# EAGLE schematic Lamp Logic Board_40 BRAIN (EAGLE 9.5.1)

## Sheet 1 of 4
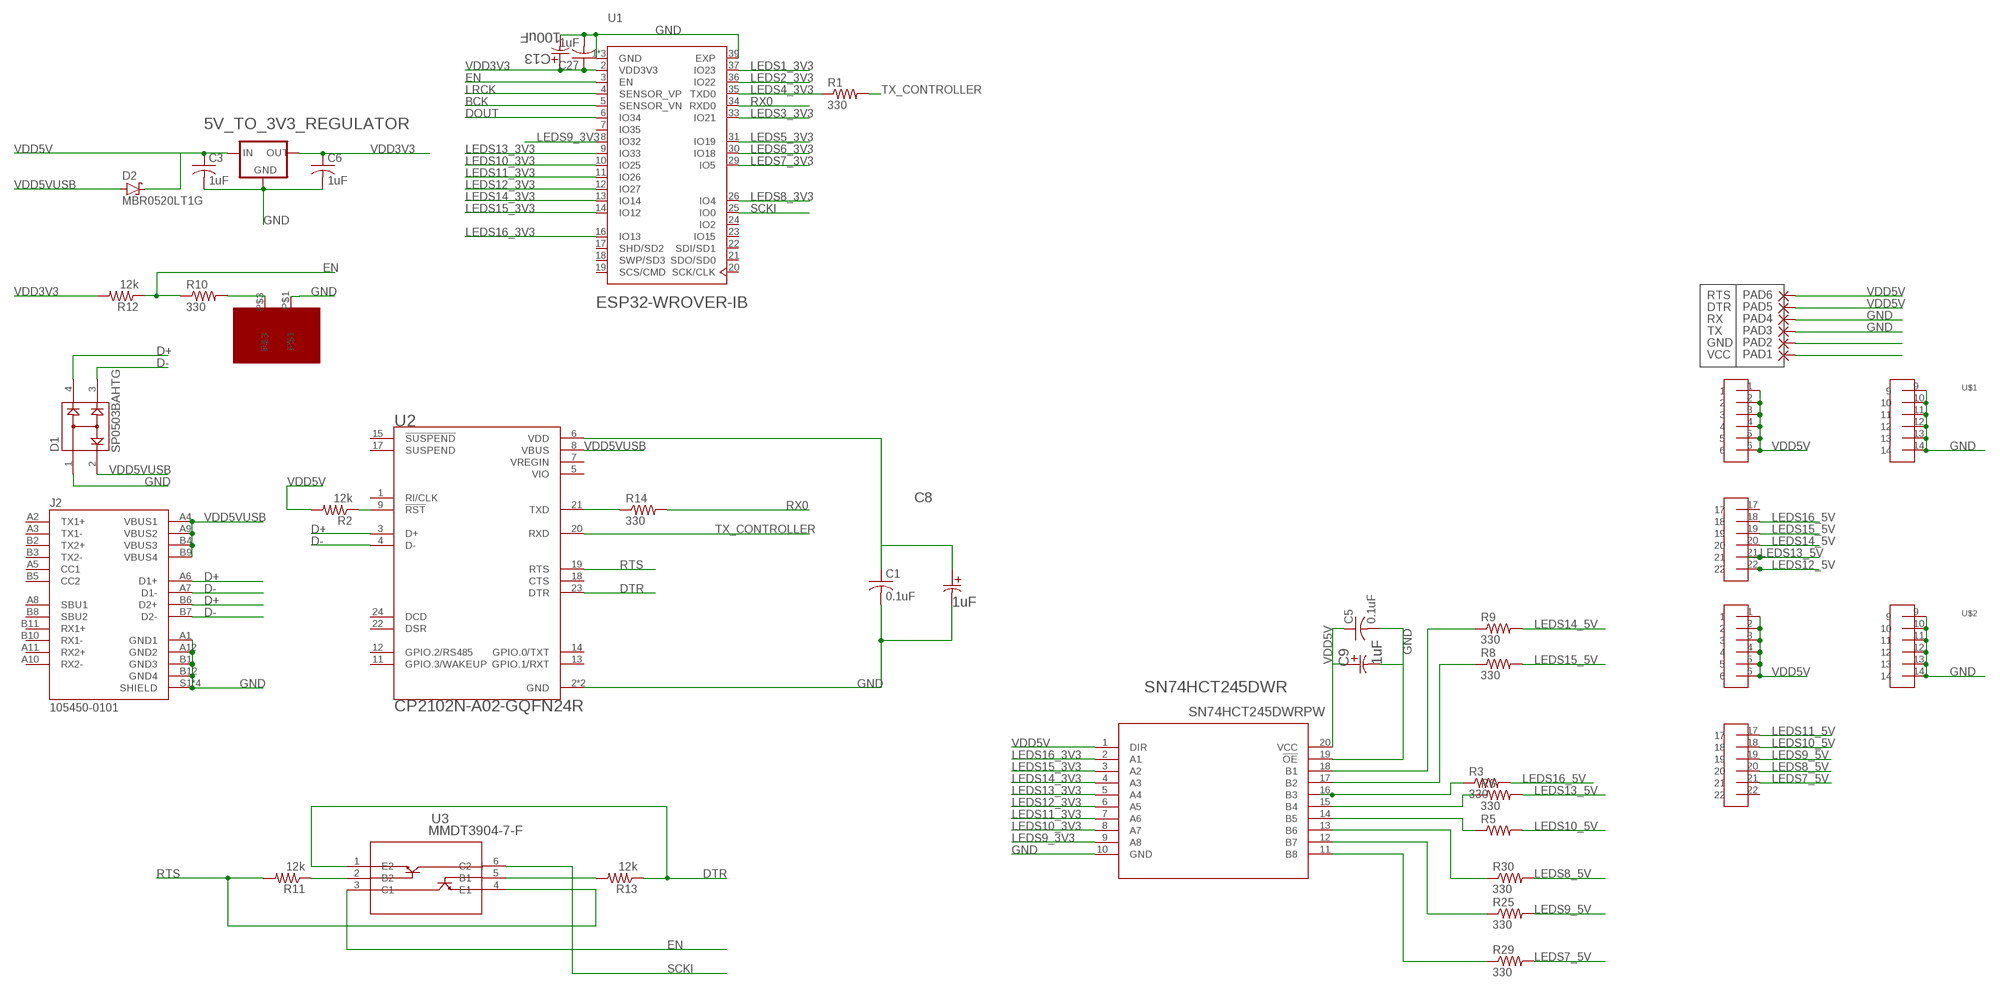
[diagram p0: schematic, sheet 1]

### Parts
5V_TO_3V3_REGULATOR  LM1117MP-1.8  [SOT223]
C1  0.1uF  C-USC0402  [C0402]
C3  1uF  C-USC0402  [C0402]
C5  0.1uF  C-USC0805  [C0805]
C6  1uF  C-USC0402  [C0402]
C8  1uF  EEEFC1V1R0R  [CAP_EEFC_B]
C9  1uF  EEEFC1V1R0R  [CAP_EEFC_B]
C13  100uF  EEEFC1V1R0R  [CAP_EEFC_B]
C27  1uF  C-USC0402  [C0402]
D1  SP0503BAHTG  [SOT143]
D2  MBR0520LT1G  [SOD-123]
J2  105450-0101  [MOLEX_105450-0101]
PAD1  VCC  WIREPADSMD1,27-254  [SMD1,27-2,54]
PAD2  GND  WIREPADSMD1,27-254  [SMD1,27-2,54]
PAD3  TX  WIREPADSMD1,27-254  [SMD1,27-2,54]
PAD4  RX  WIREPADSMD1,27-254  [SMD1,27-2,54]
PAD5  DTR  WIREPADSMD1,27-254  [SMD1,27-2,54]
PAD6  RTS  WIREPADSMD1,27-254  [SMD1,27-2,54]
R1  330  RC0603JR-070RL  [RES_0603]
R2  12k  RC0603JR-070RL  [RES_0603]
R3  330  RC0603JR-070RL  [RES_0603]
R5  330  RC0603JR-070RL  [RES_0603]
R6  330  RC0603JR-070RL  [RES_0603]
R8  330  RC0603JR-070RL  [RES_0603]
R9  330  RC0603JR-070RL  [RES_0603]
R10  330  RC0603JR-070RL  [RES_0603]
R11  12k  RC0603JR-070RL  [RES_0603]
R12  12k  RC0603JR-070RL  [RES_0603]
R13  12k  RC0603JR-070RL  [RES_0603]
R14  330  RC0603JR-070RL  [RES_0603]
R25  330  RC0603JR-070RL  [RES_0603]
R29  330  RC0603JR-070RL  [RES_0603]
R30  330  RC0603JR-070RL  [RES_0603]
SN74HCT245DWR  SN74HCT245DWRPW  [PW]
U1  ESP32-WROVER-IB  ESP32-WROVER-I  [XCVR_ESP32-WROVER-I]
U2  CP2102N-A02-GQFN24R  [SILABS_CP2102N-A02-GQFN24R]
U3  MMDT3904-7-F  [SOT-363]
U$1  3X8PINHEAD  [3X8PINHEAD]
U$2  3X8PINHEAD  [3X8PINHEAD]
U$7  TL1014BF160QG  [TL1014BF160QG]

### Nets
BCK [LED Data]: U1.5(SENSOR_VN)
D+ [LED Data]: D1.4 J2.A6(D1+) J2.B6(D2+) U2.3(D+)
D- [LED Data]: D1.3 J2.A7(D1-) J2.B7(D2-) U2.4(D-)
DOUT [LED Data]: U1.6(IO34)
DTR [LED Data]: R13.1 U2.23(DTR) U3.1(E2)
EN [LED Data]: R10.1 R12.1 U1.3(EN) U3.3(C1)
GND: 5V_TO_3V3_REGULATOR.1(GND) C1.2 C3.2 C5.2 C6.2 C8.2 C9.2 C13.2 C27.2 D1.1 J2.A1(GND1) J2.A12(GND2) J2.B1(GND3) J2.B12(GND4) J2.S1(SHIELD) J2.S2(SHIELD) J2.S3(SHIELD) J2.S4(SHIELD) PAD3.1(P) PAD4.1(P) SN74HCT245DWR.10(GND) SN74HCT245DWR.19(!OE) U1.1(GND) U1.15(GND) U1.38(GND) U1.39(EXP) U2.2(GND) U2.25(GND) U$1.9 U$1.10 U$1.11 U$1.12 U$1.13 U$1.14 U$2.9 U$2.10 U$2.11 U$2.12 U$2.13 U$2.14 U$7.P$1
LEDS1_3V3 [LED Data]: U1.37(IO23)
LEDS2_3V3 [LED Data]: U1.36(IO22)
LEDS3_3V3 [LED Data]: U1.33(IO21)
LEDS4_3V3 [LED Data]: R1.1 U1.35(TXD0)
LEDS5_3V3 [LED Data]: U1.31(IO19)
LEDS6_3V3 [LED Data]: U1.30(IO18)
LEDS7_3V3 [LED Data]: U1.29(IO5)
LEDS7_5V [LED Data]: R29.2 U$2.21
LEDS8_3V3 [LED Data]: U1.26(IO4)
LEDS8_5V [LED Data]: R30.2 U$2.20
LEDS9_3V3 [LED Data]: SN74HCT245DWR.9(A8) U1.8(IO32)
LEDS9_5V [LED Data]: R25.2 U$2.19
LEDS10_3V3 [LED Data]: SN74HCT245DWR.8(A7) U1.10(IO25)
LEDS10_5V [LED Data]: R5.2 U$2.18
LEDS11_3V3 [LED Data]: SN74HCT245DWR.7(A6) U1.11(IO26)
LEDS11_5V [LED Data]: U$2.17
LEDS12_3V3 [LED Data]: SN74HCT245DWR.6(A5) U1.12(IO27)
LEDS12_5V [LED Data]: U$1.22
LEDS13_3V3 [LED Data]: SN74HCT245DWR.5(A4) U1.9(IO33)
LEDS13_5V [LED Data]: R6.2 U$1.21
LEDS14_3V3 [LED Data]: SN74HCT245DWR.4(A3) U1.13(IO14)
LEDS14_5V [LED Data]: R9.2 U$1.20
LEDS15_3V3 [LED Data]: SN74HCT245DWR.3(A2) U1.14(IO12)
LEDS15_5V [LED Data]: R8.2 U$1.19
LEDS16_3V3 [LED Data]: SN74HCT245DWR.2(A1) U1.16(IO13)
LEDS16_5V [LED Data]: R3.2 U$1.18
LRCK [LED Data]: U1.4(SENSOR_VP)
N$1 [LED Data]: R9.1 SN74HCT245DWR.18(B1)
N$5 [LED Data]: C1.1 C8.1 U2.6(VDD)
N$7 [LED Data]: R11.1 U3.2(B2)
N$8 [LED Data]: R13.2 U3.5(B1)
N$9 [LED Data]: R10.2 U$7.P$3
N$11 [LED Data]: R6.1 SN74HCT245DWR.15(B4)
N$12 [LED Data]: R5.1 SN74HCT245DWR.14(B5)
N$14 [LED Data]: R8.1 SN74HCT245DWR.17(B2)
N$18 [LED Data]: R14.1 U2.21(TXD)
N$19 [LED Data]: R3.1 SN74HCT245DWR.16(B3)
N$26 [LED Data]: R29.1 SN74HCT245DWR.11(B8)
N$28 [LED Data]: R2.1 U2.9(!RST)
N$32: PAD2.1(P)
N$33: PAD1.1(P)
N$34 [LED Data]: R30.1 SN74HCT245DWR.13(B6)
N$35 [LED Data]: R25.1 SN74HCT245DWR.12(B7)
RTS [LED Data]: R11.2 U2.19(RTS) U3.4(E1)
RX0 [LED Data]: R14.2 U1.34(RXD0)
SCKI [LED Data]: U1.25(IO0) U3.6(C2)
TX_CONTROLLER [LED Data]: R1.2 U2.20(RXD)
VDD3V3: 5V_TO_3V3_REGULATOR.2(OUT) 5V_TO_3V3_REGULATOR.4(OUT) C6.1 C13.1 C27.1 R12.2 U1.2(VDD3V3)
VDD5V: 5V_TO_3V3_REGULATOR.3(IN) C3.1 C5.1 C9.1 D2.C PAD5.1(P) PAD6.1(P) R2.2 SN74HCT245DWR.1(DIR) SN74HCT245DWR.20(VCC) U$1.1 U$1.2 U$1.3 U$1.4 U$1.5 U$1.6 U$2.1 U$2.2 U$2.3 U$2.4 U$2.5 U$2.6
VDD5VUSB: D1.2 D2.A J2.A4(VBUS1) J2.A9(VBUS2) J2.B4(VBUS3) J2.B9(VBUS4) U2.8(VBUS)
Unconnected: J2.A2(TX1+) J2.A3(TX1-) J2.A5(CC1) J2.A8(SBU1) J2.A10(RX2-) J2.A11(RX2+) J2.B2(TX2+) J2.B3(TX2-) J2.B5(CC2) J2.B8(SBU2) J2.B10(RX1-) J2.B11(RX1+) U1.7(IO35) U1.17(SHD/SD2) U1.18(SWP/SD3) U1.19(SCS/CMD) U1.20(SCK/CLK) U1.21(SDO/SD0) U1.22(SDI/SD1) U1.23(IO15) U1.24(IO2) U2.1(RI/CLK) U2.5(VIO) U2.11(GPIO.3/WAKEUP) U2.12(GPIO.2/RS485) U2.13(GPIO.1/RXT) U2.14(GPIO.0/TXT) U2.15(!SUSPEND) U2.17(SUSPEND) U2.18(CTS) U2.22(DSR) U2.24(DCD) U$1.17 U$2.22

## Sheet 2 of 4

## Sheet 3 of 4

## Sheet 4 of 4

## Power pins joined to a net without a drawn wire
VREGIN: U2.7(VREGIN)

## Library data of the parts
5V_TO_3V3_REGULATOR = lm1117:LM1117?-*: 800mA Low-Dropout Linear Regulator Source: http://ww1.microchip.com/downloads/en/DeviceDoc/39760d.pdf; MF: Texas Instruments; MPN: LM1117MP-1.8; OC_FARNELL: 1469053; OC_NEWARK: 41K3467
C1 C3 C5 C6 C27 = resistor:C-US: CAPACITOR, American symbol
C8 C9 C13 = EEE-FC1V1R0R:EEEFC1V1R0R; MANUFACTURER_PART_NUMBER: EEEFC1V1R0R; VENDOR: Panasonic
D1 = SP0503BAHTG:SP0503BAHTG: TVS DIODE 5.5VWM 8.5VC SOT143; DESCRIPTION: SP050xBA Series 8 V 30 pF Uni-Directional SMT TVS Avalanche Diode Array SOT-143; DIGI-KEY_PART_NUMBER: F2715CT-ND; DIGI-KEY_PURCHASE_URL: https://www.digikey.com/product-detail/en/littelfuse-inc/SP0503BAHTG/F2715CT-ND/1154322?utm_source=snapeda&utm_medium=aggregator&utm_campaign=symbol; MF: Littelfuse Inc.; MP: SP0503BAHTG; PACKAGE: SOT-143 Littelfuse
D2 = Diodes:MBR0520LT1G: DIODE SCHOTTKY 20V 500MA SOD123 Manufacturer's datasheet <https://www.onsemi.com/pub/Collateral/MBR0520LT1-D.PDF>; CREATED_BY: PCBLayout.com; DIGIKEY_PART_NUMBER: MBR0520LT1GOSTR-ND; MANUFACTURER: ON Semiconductor; MPN: MBR0520LT1G; PACKAGE: SOD-123
J2 = 105450-0101:105450-0101: USB Shielded I/O Receptacle; Type C; Right Angle; Surface Mount; Gold over Nickel; DESCRIPTION: USB Shielded I/O Receptacle; Type C; Right Angle; Surface Mount; Gold over Nickel; DIGI-KEY_PART_NUMBER: WM12856CT-ND; DIGI-KEY_PURCHASE_URL: https://www.digikey.com/product-detail/en/molex/1054500101/WM12856CT-ND/5843891?utm_source=snapeda&utm_medium=aggregator&utm_campaign=symbol; MF: Molex; MP: 1054500101; PACKAGE: None
PAD1-PAD6 = wirepad:WIREPAD: Wire PAD connect wire on PCB
R1-R3 R5 R6 R8-R14 R25 R29 R30 = Resistor_Capacitor:RC0603JR-070RL: RES SMD 0 OHM JUMPER 1/10W 0603 Manufacturer's datasheet <http://www.yageo.com/documents/recent/PYu-RC_Group_51_RoHS_L_10.pdf>; CREATED_BY: PCBLayout.com; DIGIKEY_PART_NUMBER: 311-0.0GRTR-ND; MANUFACTURER: Yageo; MPN: RC0603JR-070RL; PACKAGE: SMD 0603
SN74HCT245DWR = SN74HCT245DWR :SN74HCT245DWR
U1 = ESP32-WROVER-I:ESP32-WROVER-I: Module: combo; GPIO, I2C x2, I2S x2, SDIO, SPI x3, UART x3; U.FL; AVAILABILITY: Unavailable; DESCRIPTION: Module: combo; GPIO, I2C x2, I2S x2, SDIO, SPI x3, UART x3; U.FL; MF: Espressif Systems; MP: ESP32-WROVER-I; PACKAGE: Module Espressif Systems; PRICE: None
U2 = CP2102N-A02-GQFN20R:CP2102N-A02-GQFN24R: IC USB TO UART BRIDGE QFN20
U3 = MMDT3904:MMDT3904-7-F; MANUFACTURER_PART_NUMBER: MMDT39047F; VENDOR: Diodes Inc
U$1 U$2 = 3X8PINHEAD:3X8PINHEAD
U$7 = TL1014BF160QG:TL1014BF160QG

## Net classes
1 LED Data: width 0.305 mm, drill 0.25 mm